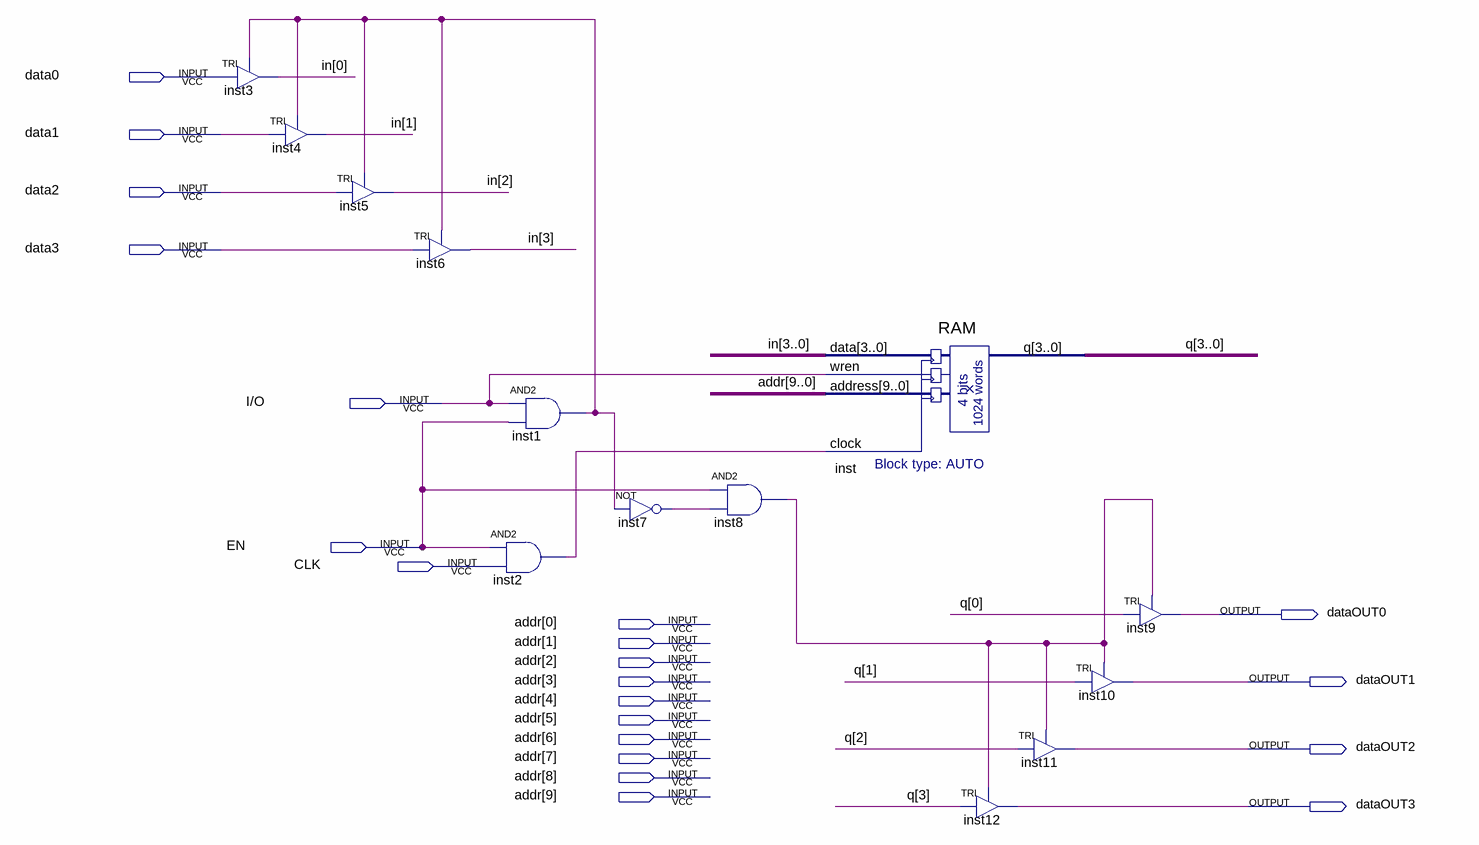
[diagram p0: schematic sheet]
// Quartus schematic 2114.bdf as structural Verilog: 13 symbols, 21 pins
module \2114  (
  input  data0,
  input  data1,
  input  data2,
  input  data3,
  input  \I/O ,
  input  EN,
  input  CLK,
  input  [9:0] addr,
  output dataOUT0,
  output dataOUT1,
  output dataOUT2,
  output dataOUT3
);

  wire inst1_out, inst2_out, inst7_out, inst8_out;
  wire [3:0] in, q;

  TRI inst3 (.IN(data0), .OE(inst1_out), .OUT(in[0]));
  TRI inst4 (.IN(data1), .OE(inst1_out), .OUT(in[1]));
  TRI inst5 (.IN(data2), .OE(inst1_out), .OUT(in[2]));
  TRI inst6 (.IN(data3), .OE(inst1_out), .OUT(in[3]));
  and inst1 (inst1_out, \I/O , EN);
  and inst2 (inst2_out, EN, CLK);
  not inst7 (inst7_out, inst1_out);
  and inst8 (inst8_out, EN, inst7_out);
  RAM inst (.data(in), .wren(\I/O ), .address(addr), .clock(inst2_out), .q(q));
  TRI inst11 (.IN(q[2]), .OE(inst8_out), .OUT(dataOUT2));
  TRI inst12 (.IN(q[3]), .OE(inst8_out), .OUT(dataOUT3));
  TRI inst10 (.IN(q[1]), .OE(inst8_out), .OUT(dataOUT1));
  TRI inst9 (.IN(q[0]), .OE(inst8_out), .OUT(dataOUT0));
endmodule
